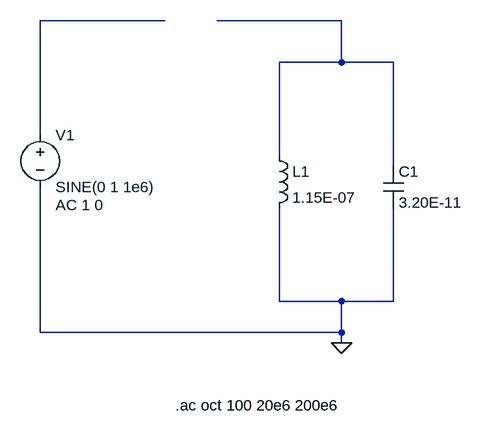
[diagram p0: schematic LCR.asc]
LCR.asc, the LTspice schematic file:
Version 4
SHEET 1 880 680
WIRE -32 -208 -224 -208
WIRE 240 -208 48 -208
WIRE 240 -144 240 -208
WIRE 240 -144 144 -144
WIRE 320 -144 240 -144
WIRE -224 -32 -224 -208
WIRE 144 0 144 -144
WIRE 320 16 320 -144
WIRE 144 224 144 80
WIRE 240 224 144 224
WIRE 320 224 320 80
WIRE 320 224 240 224
WIRE -224 272 -224 48
WIRE 240 272 240 224
WIRE 240 272 -224 272
WIRE 240 288 240 272
FLAG 240 288 0
SYMBOL ind 128 -16 R0
SYMATTR InstName L1
SYMATTR Value 1.15E-07
SYMBOL cap 304 16 R0
SYMATTR InstName C1
SYMATTR Value 3.20E-11
SYMBOL voltage -224 -48 R0
WINDOW 123 24 124 Left 2
WINDOW 39 0 0 Left 2
SYMATTR Value2 AC 1 0
SYMATTR InstName V1
SYMATTR Value SINE(0 1 1e6)
TEXT -16 384 Left 2 !.ac oct 100 20e6 200e6

The netlist it stands for:
* LCR.asc
L1 N002 0 1.15E-07
C1 N002 0 3.20E-11
V1 N001 0 SINE(0 1 1e6) AC 1 0
.ac oct 100 20e6 200e6
.backanno
.end